# Altium schematic sheet tuch-tara-btr.SchDoc
size A3
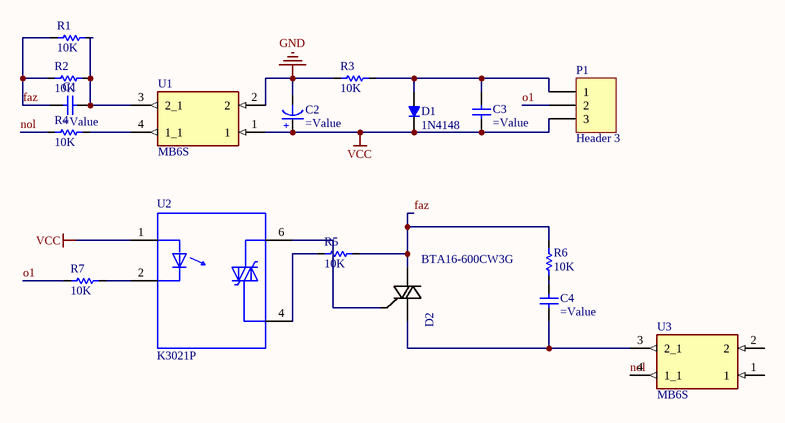
[diagram p0: tuch-tara-btr.SchDoc]

## Parts
C1  (no value)  [CAP-30]
C2  (no value)  [ELEC-CAP-RAD10-20]
C3  (no value)  [CAP 1206]
C4  (no value)  [CAP-30]
D1  MODEL: 1N4148  [DO-41]  (hidden comment: MODEL)
D2  BTA16-600CW3G  [*TO254P1028X482X1968-3]
P1  Header 3  [HDR1X3]
R1  10K  [RES 1206 (3216X08L)]
R2  10K  [Res-(1/4)]
R3  10K  [RES 1206 (3216X08L)]
R4  10K  [Res-(1/4)]
R5  10K  [RES 1206 (3216X08L)]
R6  10K  [RES 1206 (3216X08L)]
R7  10K  [RES 1206 (3216X08L)]
U1  MB6S  [SOIC245P670X270-4N]
U2  K3021P  [DIP762W50P254L730H410Q6]
U3  MB6S  [SOIC245P670X270-4N]

## Nets
GND: C2.1(-) R3.2 U1.2
VCC: C2.2(+) C3.1(+) D1.2(K) P1.3 U1.1 U2.1(A)
faz: C1.1(+) D2.2(MT2) R1.2 R2.2 R5.2 R6.2
nol: R4.2 U3.4(1_1)
o1: P1.2 R7.1
NetC1_2: C1.2(-) R1.1 R2.1 U1.3(2_1)
NetC3_2: C3.2(-) D1.1(A) P1.1 R3.1
NetC4_1: C4.1(+) D2.1(MT1) U3.3(2_1)
NetC4_2: C4.2(-) R6.1
NetD2_3: D2.3(G) U2.6(MT2)
NetR4_1: R4.1 U1.4(1_1)
NetR5_1: R5.1 U2.4(MT1)
NetR7_2: R7.2 U2.2(C)

Not connected (* = marked no-connect by the designer): U3 1 2

## Library data of the parts
C1 C3 C4 = Capacitor
C2 = Capacitor Electrolytic: Electrolytic Capacitor
D1 = Diode
D2 = BTA16-600CW3G: TRIAC Standard 600V 16A Through Hole TO-220AB; MF: Littelfuse Inc.; Package: TO-220 ON Semiconductor; SnapEDA_Link: https://www.snapeda.com/parts/BTA16-600CW3G/Littelfuse%20Inc./view-part/390940/?ref=snap; Mouser-Purchase-URL: https://snapeda.com/shop?store=Mouser&id=390940; DigiKey-Purchase-URL: https://snapeda.com/shop?store=DigiKey&id=390940; Price: None; Arrow_Americas-Purchase-URL: https://snapeda.com/shop?store=Arrow+Americas&id=390940; Availability: Unavailable; MP: BTA16-600CW3G; Value: *
P1 = Header 3: Header, 3-Pin; LatestRevisionDate: 17-Jul-2002; LatestRevisionNote: Re-released for DXP Platform.; Publisher: Altium Limited
R1-R7 = Resistor: Tolerance: 5%; Power: 1/4 W; Value: 10K
U1 U3 = MB6S: Bridge Rectifier Single Phase Standard 600V Surface Mount 4-SOIC; MF: ON Semiconductor; Digi-Key_Purchase_URL: https://www.digikey.com.tr/product-detail/en/on-semiconductor/MB6S/MB6SCT-ND/965654?utm_source=snapeda&utm_medium=aggregator&utm_campaign=symbol; Value: *; Package: BESOP-4 Surge Components; Digi-Key_Part_Number: MB6SCT-ND; SnapEDA_Link: https://www.snapeda.com/parts/MB6S/ON%20Semiconductor/view-part/2774209/?ref=snap; MP: MB6S
U2 = K3021P: Optoisolator Triac Output 5300Vrms 1 Channel 6-DIP; MF: Vishay Semiconductor; Package: DIP-6 Vishay; Availability: Unavailable; Value: *; MP: K3021P; Mouser-Purchase-URL: https://snapeda.com/shop?store=Mouser&id=291595; SnapEDA_Link: https://www.snapeda.com/parts/K3021P/Vishay%20Semiconductor%20Opto%20Division/view-part/291595/?ref=snap; Price: None; DigiKey-Purchase-URL: https://snapeda.com/shop?store=DigiKey&id=291595